# Altium schematic sheet [08] - Voltage Regulator.SchDoc: Voltage Regulator
size A3; Date: N.A.; ApprovedBy: N.A.; CheckedBy: N.A.; Author: N.A.; CompanyName: Johannes Berndorfer; DrawnBy: JBE; Organization: N.A.; Address1: Konrad Grefe Gasse 22; Address2: 1230 Wien; Address3: AUSTRIA; Address4: N.A.; DocumentNumber: 8; Revision: A; SheetNumber: 8; SheetTotal: 8; ProjectTitle: Berndo Keyboard Switchboard PCB; Reviewer: -; Time: N.A.; ImagePath: N.A.; Application_BuildNumber: N.A.
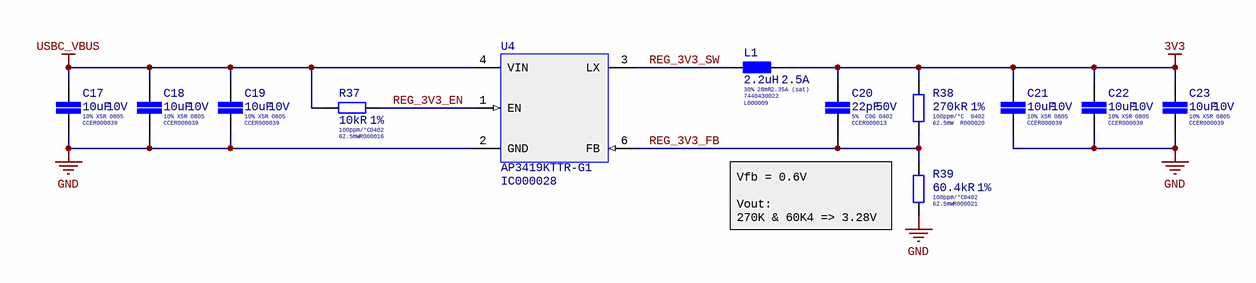
[diagram p0: [08] - Voltage Regulator.SchDoc]

## Parts
C17  Internal Part Number: CCER000039  Tolerance: 10%  Voltage Rating: 10V  Dielectric: X5R  Case/Package: 0805  Capacitance: 10uF  [CAP-SMD-0805-1.35MM-IPC-MED]  (hidden comment: 10uF 10V)
C18  Internal Part Number: CCER000039  Tolerance: 10%  Voltage Rating: 10V  Dielectric: X5R  Case/Package: 0805  Capacitance: 10uF  [CAP-SMD-0805-1.35MM-IPC-MED]  (hidden comment: 10uF 10V)
C19  Internal Part Number: CCER000039  Tolerance: 10%  Voltage Rating: 10V  Dielectric: X5R  Case/Package: 0805  Capacitance: 10uF  [CAP-SMD-0805-1.35MM-IPC-MED]  (hidden comment: 10uF 10V)
C20  Internal Part Number: CCER000013  Voltage Rating: 50V  Tolerance: 5%  Dielectric: C0G  Case/Package: 0402  Capacitance: 22pF  [CAP-SMD-0402-0.55MM-IPC-MED]  (hidden comment: 22pF 50V)
C21  Internal Part Number: CCER000039  Tolerance: 10%  Voltage Rating: 10V  Dielectric: X5R  Case/Package: 0805  Capacitance: 10uF  [CAP-SMD-0805-1.35MM-IPC-MED]  (hidden comment: 10uF 10V)
C22  Internal Part Number: CCER000039  Tolerance: 10%  Voltage Rating: 10V  Dielectric: X5R  Case/Package: 0805  Capacitance: 10uF  [CAP-SMD-0805-1.35MM-IPC-MED]  (hidden comment: 10uF 10V)
C23  Internal Part Number: CCER000039  Tolerance: 10%  Voltage Rating: 10V  Dielectric: X5R  Case/Package: 0805  Capacitance: 10uF  [CAP-SMD-0805-1.35MM-IPC-MED]  (hidden comment: 10uF 10V)
L1  Saturation Current: 2.35A (sat)  Internal Part Number: L000009  Inductance Tolerance: 30%  DC Resistance (DCR): 28mR  Current Rating: 2.5A  Inductance: 2.2uH  [IND-SMD-7440430022-3MM]  (hidden comment: 7440430022)
R37  Tolerance: 1%  Temperature Coefficient: 100ppm/°C  Resistance: 10kR  Power Rating: 62.5mW  Case Code (Imperial): 0402  Internal Part Number: R000016  [RES-SMD-0402-0.4MM-IPC-MED]  (hidden comment: 10kR 1%)
R38  Case/Package: 0402  Tolerance: 1%  Temperature Coefficient: 100ppm/°C  Resistance: 270kR  Max Power Dissipation: 62.5mW  Internal Part Number: R000020  [RES-SMD-0402-0.4MM-IPC-MED]  (hidden comment: RC0402FR-07270KL)
R39  Resistance: 60.4kR  Tolerance: 1%  Temperature Coefficient: 100ppm/°C  Case/Package: 0402  Power Rating: 62.5mW  Internal Part Number: R000021  [RES-SMD-0402-0.4MM-IPC-MED]  (hidden comment: RC0402FR-0760K4L)
U4  AP3419KTTR-G1  Internal Part Number: IC000028  [SOT-23-6-H1MM-DIODES-INC]

## Nets
3V3: C20.1 C21.1 C22.1 C23.1 L1.2 R38.1
GND: C17.2 C18.2 C19.2 C21.2 C22.2 C23.2 R39.2 U4.2(GND)
USBC_VBUS: C17.1 C18.1 C19.1 R37.1 U4.4(VIN)
REG_3V3_EN: R37.2 U4.1(EN)
REG_3V3_FB: C20.2 R38.2 R39.1 U4.6(FB)
REG_3V3_SW: L1.1 U4.3(LX)

## Notes on the sheet
- (near R39) Vfb = 0.6V
  Vout:
  270K & 60K4 => 3.28V
- Title:
- Project:
- Document Nr.:
- Revision:
- Date:
- Drawn By:
- Time:
- Reviewed By:
- Sheet
- of
- Size:
- A3
- Variant:
- File:

## Library data of the parts
C17-C19 C21-C23 = CL21A106KPFNNNG: CAP CER 10U 10V X5R 10% SMD 0805 85C SAMSUNG; Supplier 1: Digi-Key; Manufacturer 1: Samsung; Manufacturer Part Number 1: CL21A106KPFNNNG; Stock 1: 884042; Pricing 1: 1=0,14000, 10=0,10000, 100=0,04690, 500=0,03290, 1000=0,02724 (USD); RoHS: Yes; Mount: Surface Mount; Case Code (Metric): 2012; Case Code (Imperial): 0805; Min Operating Temperature: -55°C; Max Operating Temperature: 85°C; Voltage: 10V; Packaging: Tape and Reel; Package Quantity: 3000; Termination: Wraparound; Length: 2mm; Height: 1.25mm; Depth: 1.25mm; Width: 0.049inch; Thickness: 0.053inch; Radiation Hardening: No; Lead Free: Lead Free; ComponentLink1URL: https://datasheet.ciiva.com/16428/cl21a106kpfnnng-16428896.pdf?src-supplier=Future+Electronics; ComponentLink1Description: https://datasheet.ciiva.com/16428/cl21a106kpfnnng-16428896.pdf?src-supplier=Future+Electronics; ComponentLink2URL: https://datasheet.ciiva.com/26936/getdatasheetpartid-640497-26936900.pdf?src-supplier=Verical; ComponentLink2Description: https://datasheet.ciiva.com/26936/getdatasheetpartid-640497-26936900.pdf?src-supplier=Verical; Supplier Part Number 1: 1276-6456-1-ND
C20 = CL05C220JB5NNNC: CAP CER 22P 50V C0G 5% SMD 0402 125C SAMSUNG; Material: Ceramic; Temperature Coefficient: 300ppm/°C; Supplier 1: Digi-Key; Manufacturer: Samsung; Manufacturer Part Number: CL05C220JB5NNNC; Stock 1: 1663917; Pricing 1: 1 = 0,10000, 10 = 0,03300, 100 = 0,01480, 500 = 0,01058, 1000 = 0,00831, 2500 = 0,00755, 5000 = 0,00695 (USD); RoHS: Yes; Mount: Surface Mount; Case Code (Metric): 1005; Case Code (Imperial): 0402; Contact Plating: Tin; Min Operating Temperature: -55°C; Max Operating Temperature: 125°C; Package Quantity: 1; Packaging: Tape and Reel; Voltage: 50V; Length: 1mm; Height: 0.5mm; Width: 0.02inch; Thickness: 0.022inch; Depth: 0.5mm; Radiation Hardening: No; ComponentLink1URL: https://datasheet.ciiva.com/15195/getdatasheetpartid-358448-15195679.pdf?src-supplier=Verical; ComponentLink1Description: https://datasheet.ciiva.com/15195/getdatasheetpartid-358448-15195679.pdf?src-supplier=Verical; ComponentLink2URL: https://datasheet.ciiva.com/29198/458663-da-01-en-vs-kondensator-0402-29198414.pdf?src-supplier=Conrad; ComponentLink2Description: https://datasheet.ciiva.com/29198/458663-da-01-en-vs-kondensator-0402-29198414.pdf?src-supplier=Conrad; ComponentLink3URL: https://datasheet.ciiva.com/16199/cl05b104kq5nnnc-16199080.pdf?src-supplier=Future+Electronics; ComponentLink3Description: https://datasheet.ciiva.com/16199/cl05b104kq5nnnc-16199080.pdf?src-supplier=Future+Electronics; ComponentLink4URL: https://datasheet.ciiva.com/26309/mlcc-catalogdownload2013-eng-26309032.pdf?src-supplier=Distrelec; ComponentLink4Description: https://datasheet.ciiva.com/26309/mlcc-catalogdownload2013-eng-26309032.pdf?src-supplier=Distrelec; Supplier Part Number 1: 1276-1116-1-ND
L1 = 7440430022: IND 2U2 2A5 28mR 30% SMD FERRITE WURTH; Manufacturer: Wurth Electronics; Shielding: Shielded; Self Resonant Frequency: 100MHz; Test Frequency: 100kHz; Supplier 1: Digi-Key; Stock 1: 3943; Pricing 1: 1 = 1,43000, 10 = 1,38900, 50 = 1,31900, 100 = 1,21500, 250 = 1,14600 (USD); RoHS: Yes; Mount: Surface Mount; Case/Package: 1919; Weight: 0.009065oz; Core Material: Ferrite; Case Code (Metric): 4848; Case Code (Imperial): 1919; Min Operating Temperature: -40°C; Max Operating Temperature: 125°C; Package Quantity: 500; Packaging: Tape and Reel; Tolerance: 30%; Composition: Wirewound; Max DC Current: 2.5A; Termination: SMD/SMT; RMS Current (Irms): 2.5A; Series Resistance: 28mR; Length: 4.8mm; Height: 2.8mm; Width: 4.8mm; Height - Seated (Max): 0.118inch; Depth: 4.8mm; REACH SVHC: Unknown; Lead Free: Lead Free; ComponentLink1URL: https://datasheet.ciiva.com/11803/0900766b80febc3e-11803289.pdf?src-supplier=RSComponents; ComponentLink1Description: https://datasheet.ciiva.com/11803/0900766b80febc3e-11803289.pdf?src-supplier=RSComponents; ComponentLink2URL: https://datasheet.ciiva.com/7754/1735426-7754427.pdf?src-supplier=Element14; ComponentLink2Description: https://datasheet.ciiva.com/7754/1735426-7754427.pdf?src-supplier=Element14; ComponentLink3URL: https://datasheet.ciiva.com/13277/7440430022-66848-13277005.pdf?src-supplier=Mouser; ComponentLink3Description: https://datasheet.ciiva.com/13277/7440430022-66848-13277005.pdf?src-supplier=Mouser; ComponentLink4URL: https://datasheet.ciiva.com/1075/7440430022-1075984.pdf?src-supplier=Digi-Key; ComponentLink4Description: https://datasheet.ciiva.com/1075/7440430022-1075984.pdf?src-supplier=Digi-Key; ComponentLink5URL: https://datasheet.ciiva.com/23782/1645803-23782392.pdf?src-supplier=Newark; ComponentLink5Description: https://datasheet.ciiva.com/23782/1645803-23782392.pdf?src-supplier=Newark; ComponentLink6URL: https://datasheet.ciiva.com/1075/7440430022-1075985.pdf?src-supplier=Digi-Key; ComponentLink6Description: https://datasheet.ciiva.com/1075/7440430022-1075985.pdf?src-supplier=Digi-Key; ComponentLink7URL: https://datasheet.ciiva.com/1075/7440430022-1075986.pdf?src-supplier=Digi-Key; ComponentLink7Description: https://datasheet.ciiva.com/1075/7440430022-1075986.pdf?src-supplier=Digi-Key; ComponentLink8URL: https://datasheet.ciiva.com/48690/001087187-da-01-ml-we-tpc-smd-speicherdrossel-7440430-de-en-48690886.pdf?src-supplier=Conrad; ComponentLink8Description: https://datasheet.ciiva.com/48690/001087187-da-01-ml-we-tpc-smd-speicherdrossel-7440430-de-en-48690886.pdf?src-supplier=Conrad; Supplier Part Number 1: 732-1095-1-ND; Manufacturer Part Number: 7440430022
R37 = RC0402FR-0710KL: RES 10K 1% 1/16W SMD 0402 YAEGO; Manufacturer: Yageo; Voltage Rating: 50V; Manufacturer Part Number: RC0402FR-0710KL; RoHS: Yes; Case/Package: 0402; Number of Pins: 2; Case Code (Metric): 1005; Min Operating Temperature: -55°C; Max Operating Temperature: 155°C; Packaging: Tape and Reel; Composition: Thick Film; Voltage Rating (DC): 50V; Termination: SMD/SMT; Military Standard: Not; Working Voltage: 50V; Number of Terminations: 2; Length: 1mm; Height: 0.32mm; Width: 0.5mm; Depth: 0.5mm; Lead Pitch: 0.2mm; REACH SVHC: No SVHC; Lead Free: Lead Free; ComponentLink1URL: https://datasheet.ciiva.com/7660/38568-7660787.pdf?src-supplier=Element14; ComponentLink1Description: https://datasheet.ciiva.com/7660/38568-7660787.pdf?src-supplier=Element14; ComponentLink2URL: https://datasheet.ciiva.com/7849/1784430-7849813.pdf?src-supplier=Element14; ComponentLink2Description: https://datasheet.ciiva.com/7849/1784430-7849813.pdf?src-supplier=Element14; ComponentLink3URL: https://datasheet.ciiva.com/7849/1686128-7849814.pdf?src-supplier=Element14; ComponentLink3Description: https://datasheet.ciiva.com/7849/1686128-7849814.pdf?src-supplier=Element14; ComponentLink4URL: https://datasheet.ciiva.com/7849/1784430-7849815.pdf?src-supplier=Element14; ComponentLink4Description: https://datasheet.ciiva.com/7849/1784430-7849815.pdf?src-supplier=Element14; ComponentLink5URL: https://datasheet.ciiva.com/22747/1018594-22747512.pdf?src-supplier=Element14; ComponentLink5Description: https://datasheet.ciiva.com/22747/1018594-22747512.pdf?src-supplier=Element14; ComponentLink6URL: https://datasheet.ciiva.com/12667/pyu-rc0402-51-rohs-l-6-r-12667067.pdf?src-supplier=Mouser; ComponentLink6Description: https://datasheet.ciiva.com/12667/pyu-rc0402-51-rohs-l-6-r-12667067.pdf?src-supplier=Mouser; ComponentLink7URL: https://datasheet.ciiva.com/7983/1018594-7983486.pdf?src-supplier=Element14; ComponentLink7Description: https://datasheet.ciiva.com/7983/1018594-7983486.pdf?src-supplier=Element14; Package Quantity: 10000; ComponentLink8URL: https://datasheet.ciiva.com/11819/0900766b80c66297-11819487.pdf?src-supplier=RSComponents; ComponentLink8Description: https://datasheet.ciiva.com/11819/0900766b80c66297-11819487.pdf?src-supplier=RSComponents; ComponentLink9URL: https://datasheet.ciiva.com/15189/getdatasheetpartid-329253-15189431.pdf?src-supplier=Verical; ComponentLink9Description: https://datasheet.ciiva.com/15189/getdatasheetpartid-329253-15189431.pdf?src-supplier=Verical; ComponentLink10URL: https://datasheet.ciiva.com/24070/pyu-rc0402-51-rohs-l-6-r-8721-24070077.pdf?src-supplier=Mouser; ComponentLink10Description: https://datasheet.ciiva.com/24070/pyu-rc0402-51-rohs-l-6-r-8721-24070077.pdf?src-supplier=Mouser; ComponentLink11URL: https://datasheet.ciiva.com/7849/1018594-7849966.pdf?src-supplier=Element14; ComponentLink11Description: https://datasheet.ciiva.com/7849/1018594-7849966.pdf?src-supplier=Element14; ComponentLink12URL: https://datasheet.ciiva.com/7849/1018594-7849967.pdf?src-supplier=Element14; ComponentLink12Description: https://datasheet.ciiva.com/7849/1018594-7849967.pdf?src-supplier=Element14; ComponentLink13URL: https://datasheet.ciiva.com/17070/pyu-rc0402-51-rohs-l-6-r-17070335.pdf?src-supplier=Future+Electronics; ComponentLink13Description: https://datasheet.ciiva.com/17070/pyu-rc0402-51-rohs-l-6-r-17070335.pdf?src-supplier=Future+Electronics; Supplier 1: Digi-Key; Stock 1: 86154015; Pricing 1: 1 = 0,10000, 10 = 0,01600, 100 = 0,00670, 1000 = 0,00301, 2500 = 0,00261, 5000 = 0,00215 (USD); Supplier Part Number 1: 311-10.0KLRCT-ND
R38 = RC0402FR-07270KL: RES 270K 1% 1/16W SMD 0402 YAEGO; Manufacturer: Yageo; Power Rating: 63mW; Voltage Rating: 50V; Supplier 1: Digi-Key; Manufacturer Part Number: RC0402FR-07270KL; Stock 1: 339624; Pricing 1: 1 = 0,10000, 10 = 0,01600, 100 = 0,00640, 1000 = 0,00289, 2500 = 0,00251, 5000 = 0,00207 (USD); RoHS: Yes; Weight: 2.3E-05oz; Case Code (Imperial): 0402; Case Code (Metric): 1005; Min Operating Temperature: -55°C; Max Operating Temperature: 155°C; Packaging: Tape and Reel; Package Quantity: 1; Termination: SMD/SMT; Composition: Thick Film; Number of Terminations: 2; Military Standard: Not; Features: Moisture Resistant; Length: 1mm; Height: 0.016inch; Width: 0.5mm; Depth: 0.5mm; REACH SVHC: Unknown; Lead Free: Lead Free; ComponentLink1URL: https://datasheet.ciiva.com/2491/pyu-r-int-thick-7-2491341.pdf?src-supplier=Digi-Key; ComponentLink1Description: https://datasheet.ciiva.com/2491/pyu-r-int-thick-7-2491341.pdf?src-supplier=Digi-Key; ComponentLink2URL: https://datasheet.ciiva.com/15189/getdatasheetpartid-327811-15189397.pdf?src-supplier=Verical; ComponentLink2Description: https://datasheet.ciiva.com/15189/getdatasheetpartid-327811-15189397.pdf?src-supplier=Verical; ComponentLink3URL: https://datasheet.ciiva.com/16772/pyu-rc0402-51-rohs-l-6-r-16772665.pdf?src-supplier=Future+Electronics; ComponentLink3Description: https://datasheet.ciiva.com/16772/pyu-rc0402-51-rohs-l-6-r-16772665.pdf?src-supplier=Future+Electronics; ComponentLink4URL: https://datasheet.ciiva.com/2491/pyu-r-int-thick-7-2491339.pdf?src-supplier=Digi-Key; ComponentLink4Description: https://datasheet.ciiva.com/2491/pyu-r-int-thick-7-2491339.pdf?src-supplier=Digi-Key; ComponentLink5URL: https://datasheet.ciiva.com/2491/pyu-r-int-thick-7-2491340.pdf?src-supplier=Digi-Key; ComponentLink5Description: https://datasheet.ciiva.com/2491/pyu-r-int-thick-7-2491340.pdf?src-supplier=Digi-Key; Supplier Part Number 1: 311-270KLRCT-ND
R39 = RC0402FR-0760K4L: RES 60K4 1% 1/16W SMD 0402 YAEGO; Manufacturer: Yageo; Voltage Rating: 50V; Supplier 1: Digi-Key; Manufacturer Part Number: RC0402FR-0760K4L; Stock 1: 969860; Pricing 1: 1 = 0,10000, 10 = 0,01600, 100 = 0,00640, 1000 = 0,00289, 2500 = 0,00251, 5000 = 0,00207 (USD); RoHS: Yes; Case Code (Imperial): 0402; Case Code (Metric): 1005; Contact Plating: Tin,Matte; Min Operating Temperature: -55°C; Max Operating Temperature: 155°C; Packaging: Tape and Reel; Termination: SMD/SMT; Composition: Thick Film; Military Standard: Not; Voltage Rating (DC): 50V; Length: 1mm; Depth: 0.5mm; Width: 500um; Lead Free: Lead Free; ComponentLink1URL: https://datasheet.ciiva.com/17068/pyu-rc0402-51-rohs-l-6-r-17068614.pdf?src-supplier=Future+Electronics; ComponentLink1Description: https://datasheet.ciiva.com/17068/pyu-rc0402-51-rohs-l-6-r-17068614.pdf?src-supplier=Future+Electronics; ComponentLink2URL: https://datasheet.ciiva.com/28398/pyu-rc0402-51-rohs-l-6-28398086.pdf?src-supplier=Avnet+Europe; ComponentLink2Description: https://datasheet.ciiva.com/28398/pyu-rc0402-51-rohs-l-6-28398086.pdf?src-supplier=Avnet+Europe; ComponentLink3URL: https://datasheet.ciiva.com/16867/pyu-rc0402-51-rohs-l-6-16867357.pdf?src-supplier=Avnet+Europe; ComponentLink3Description: https://datasheet.ciiva.com/16867/pyu-rc0402-51-rohs-l-6-16867357.pdf?src-supplier=Avnet+Europe; ComponentLink4URL: https://datasheet.ciiva.com/8888/pyu-rc0402-51-rohs-l-6-8888622.pdf?src-supplier=Avnet; ComponentLink4Description: https://datasheet.ciiva.com/8888/pyu-rc0402-51-rohs-l-6-8888622.pdf?src-supplier=Avnet; Supplier Part Number 1: 311-60.4KLRCT-ND
U4 = AP3419KTTR-G1: IC REGULATOR BUCK 2A SYNC 1MHZ SOT-23-6; Manufacturer: Diodes; Number of Outputs: 1; Min Input Voltage: 2.7V; Max Input Voltage: 5.5V; Min Output Voltage: 600mV; Synchronous Rectifier: Yes; Output Type: Adjustable; Output Configuration: Positive; Supplier 1: Digi-Key; Manufacturer Part Number: AP3419KTTR-G1; Stock 1: 72992; Pricing 1: 1 = 0,42000, 10 = 0,33900, 100 = 0,23070, 500 = 0,17304, 1000 = 0,12978 (USD); RoHS: Yes; Mount: Surface Mount; Case/Package: SOT-23-6; Min Operating Temperature: -40°C; Max Operating Temperature: 85°C; Packaging: Tape and Reel; Max Output Voltage: 5.5V; Output Current: 2A; Switching Frequency: 1MHz; ComponentLink1URL: https://www.diodes.com/assets/Datasheets/AP3419.pdf?src-supplier=Digi-Key; ComponentLink1Description: https://www.diodes.com/assets/Datasheets/AP3419.pdf?src-supplier=Digi-Key; Supplier Part Number 1: AP3419KTTR-G1DICT-ND